# EAGLE design MPU6050 (EAGLE 9.6.2)
COMPANY: ADAFRUIT INDUSTRIES; DRAWN: KTOWN; REV: A; YEAR: 2019
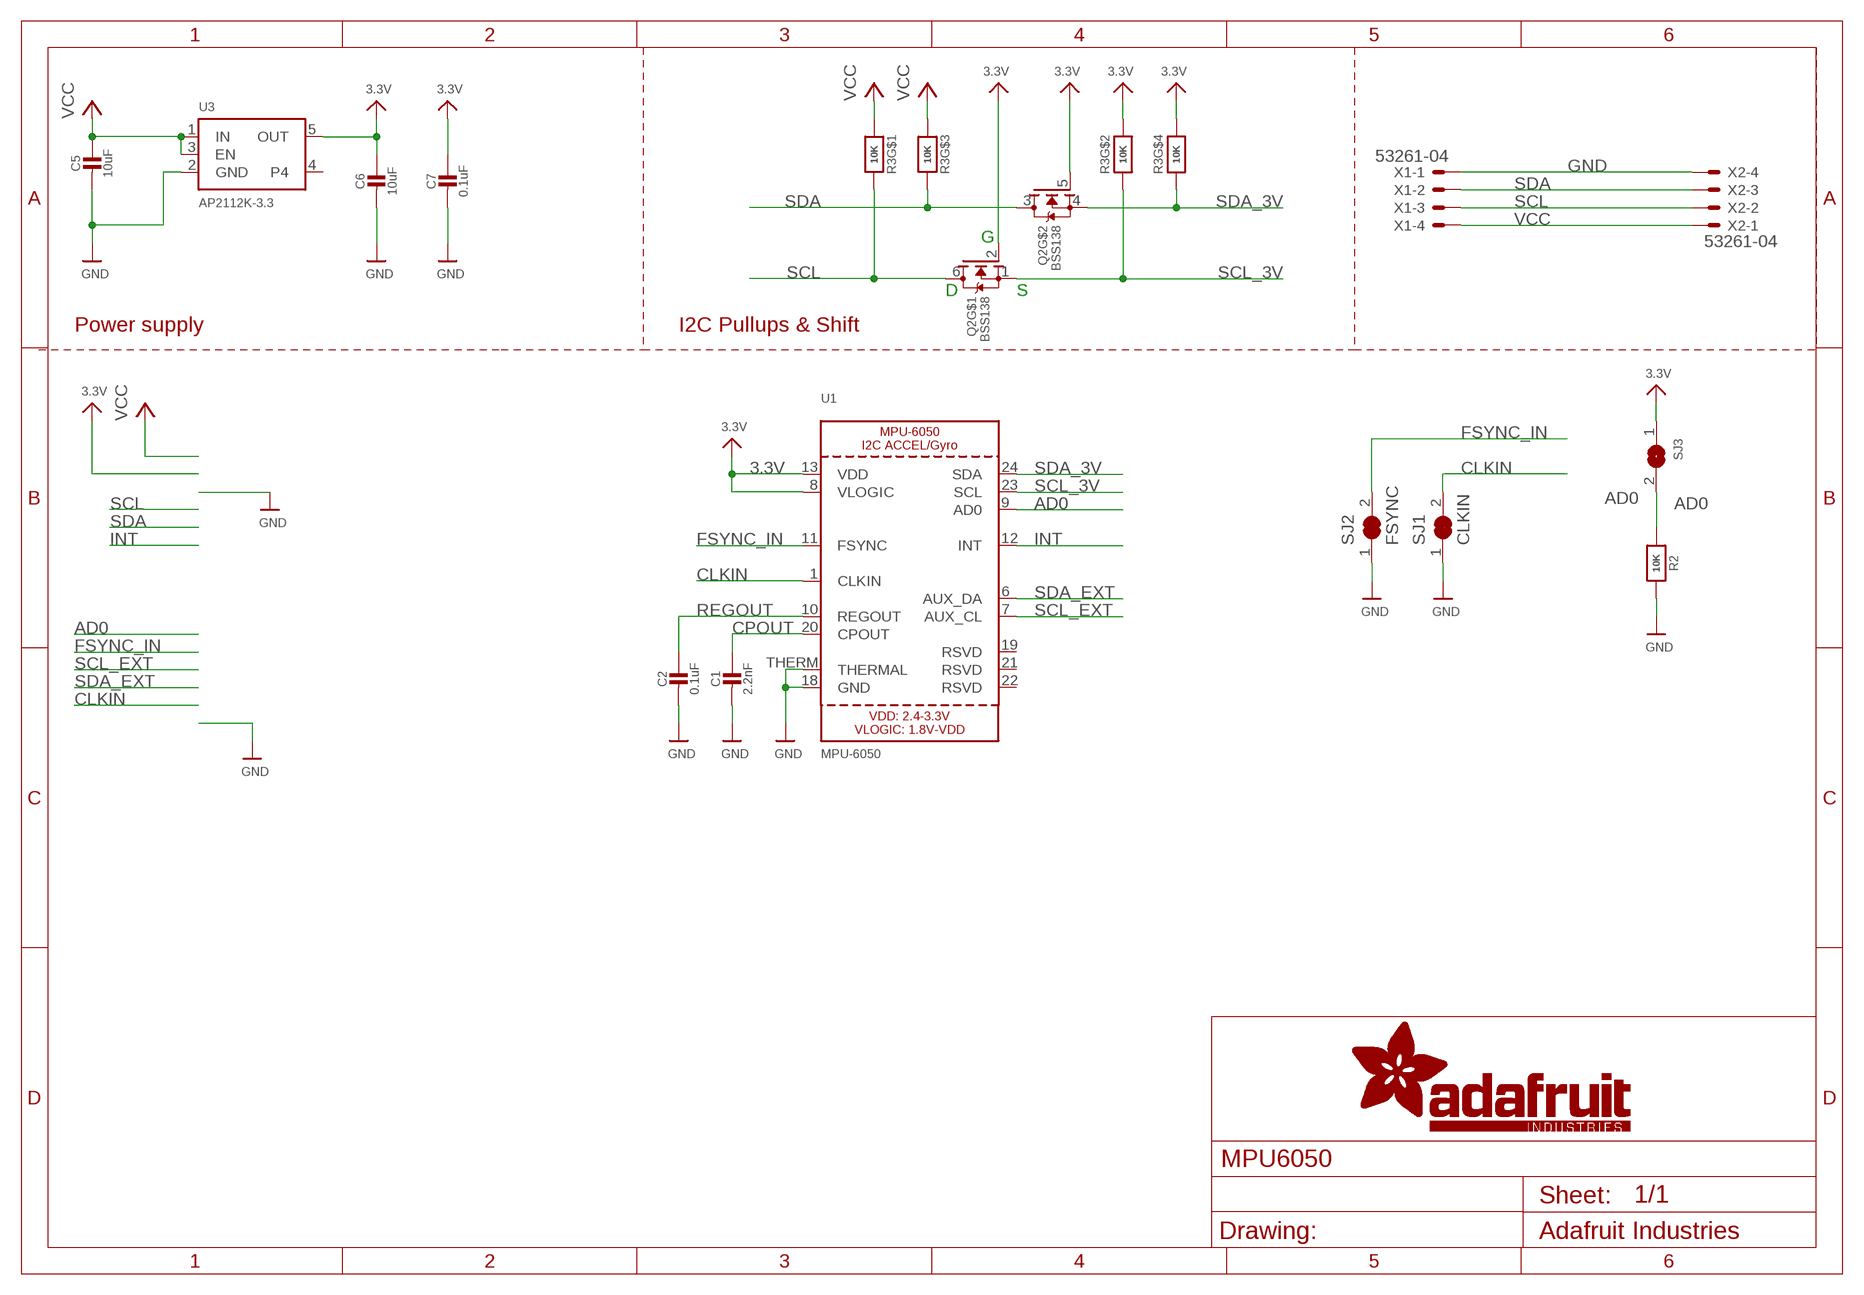
[diagram p0: schematic, sheet 1]

## Parts
C1  2.2nF  CAP_CERAMIC0603_NO  [0603-NO]
C2  0.1uF  CAP_CERAMIC0603_NO  [0603-NO]
C5  10uF  CAP_CERAMIC0805-NOOUTLINE  [0805-NO]
C6  10uF  CAP_CERAMIC0805-NOOUTLINE  [0805-NO]
C7  0.1uF  CAP_CERAMIC0603_NO  [0603-NO]
Q2  BSS138  MOSFET-N_DUAL  [SOT363]
R2  10K  RESISTOR_0603_NOOUT  [0603-NO]
R3  10K  RESISTOR_4PACK  [RESPACK_4X0603]
SJ1  CLKIN  SOLDERJUMPER_CLOSED  [SOLDERJUMPER_CLOSEDWIRE]
SJ2  FSYNC  SOLDERJUMPER_CLOSED  [SOLDERJUMPER_CLOSEDWIRE]
SJ3  SOLDERJUMPER  [SOLDERJUMPER_ARROW_NOPASTE]
U1  MPU-6050  [QFN24_4MM_SMSC]
U3  AP2112K-3.3  VREG_SOT23-5  [SOT23-5]
X1  53261-04  [53261-04]
X2  53261-04  [53261-04]

## Nets
3.3V: C6.1 C7.1 Q2.2(G) Q2.5(G) R3.2 R3.4 SJ3.1 U1.8(VLOGIC) U1.13(VDD) U3.5(OUT)
AD0: R2.1 SJ3.2 U1.9(AD0)
CLKIN: SJ1.2 U1.1(CLKIN)
CPOUT: C1.1 U1.20(CPOUT)
FSYNC_IN: SJ2.2 U1.11(FSYNC)
GND: C1.2 C2.2 C5.2 C6.2 C7.2 R2.2 SJ1.1 SJ2.1 U1.18(GND) U1.THERM(THERMAL) U3.2(GND) X1.1 X2.4
INT: U1.12(INT)
REGOUT: C2.1 U1.10(REGOUT)
SCL: Q2.6(D) R3.8 X1.3 X2.2
SCL_3V: Q2.1(S) R3.7 U1.23(SCL)
SCL_EXT: U1.7(AUX_CL)
SDA: Q2.3(D) R3.6 X1.2 X2.3
SDA_3V: Q2.4(S) R3.5 U1.24(SDA)
SDA_EXT: U1.6(AUX_DA)
VCC [highpower]: C5.1 R3.1 R3.3 U3.1(IN) U3.3(EN) X1.4 X2.1
Unconnected: U1.19(RSVD) U1.21(RSVD) U1.22(RSVD) U3.4

## Notes on the sheet
- G
- D | S
- Power supply | I2C Pullups & Shift

## Library data of the parts
C1 C2 C5-C7 = microbuilder:CAP_CERAMIC: Ceramic Capacitors For new designs, use the packages preceded by an '_' character since they are more reliable: The following footprints should be used on most boards: _0402 - Standard footprint for regular board layouts _0603 - Standard footprint for regular board layouts _0805 - Standard footprint for regular board layouts _1206 - Standard footprint for regular board layouts For extremely tight-pitch boards where space is at a premium, the following 'micro-pitch' footprints can be used (smaller pads, no silkscreen outline, etc.): _0402MP - Micro-pitch footprint for very dense/compact boards _0603MP - Micro-pitch footprint for very dense/compact boards _0805MP - Micro-pitch footprint for very dense/compact boards _1206MP - Micro-pitch footprint for very dense/compact boards
Q2 = microbuilder:MOSFET-N_DUAL: Dual N-Channel MOSFET SOT363 (2.0x1.25mm) 2N7002PS - 60V, 320mA [Digikey: 568-5984-1-ND]
R2 = microbuilder:RESISTOR: Resistors For new designs, use the packages preceded by an '_' character since they are more reliable: The following footprints should be used on most boards: _0402 - Standard footprint for regular board layouts _0603 - Standard footprint for regular board layouts _0805 - Standard footprint for regular board layouts _1206 - Standard footprint for regular board layouts For extremely tight-pitch boards where space is at a premium, the following 'micro-pitch' footprints can be used (smaller pads, no silkscreen outline, etc.): _0402MP - Micro-pitch footprint for very dense/compact boards _0603MP - Micro-pitch footprint for very dense/compact boards _0805MP - Micro-pitch footprint for very dense/compact boards _1206MP - Micro-pitch footprint for very dense/compact boards
R3 = microbuilder:RESISTOR_4PACK: Resistor Packs (4 resistors) 4 x 0603 10K 1/16W - Digikey: YC164J-10KCT-ND
SJ1 SJ2 = microbuilder:SOLDERJUMPER_CLOSED: Solder Jumper - Closed These solder jumpers are closed by default CLOSEDWIRE - 10 mil trace between pads that can be cut and resoldered later CLOSEDPERM - 63 mil trace between pads for a permanent connection (used to 'bridge' two signals, a shameless hack for Eagle). Can double as a test point as well (no cream layer)
SJ3 = microbuilder:SOLDERJUMPER: SMD Solder JUMPER Solder the two pads together to create a connection, or remove the solder to break it. REFLOW - Use this footprint for solder paste and reflow ovens. WAVE - Use this footprint for hand-soldering (larger pads). CLOSED - Has a trace between the two pads to ensure it is closed by default. The trace needs to be cut to disable the jumper, and can be closed again by creating a solder bridge between the two pads.; BOM: EXCLUDE
U1 = microbuilder:MPU-6050: MPU-6050 3-Axis Accelerometer/Gyroscope
U3 = microbuilder:VREG_SOT23-5: SOT23-5 Fixed Voltage Regulators Part Current Out V Out V In V Dropout θJA (°C/W) TJ (°C) Digikey Part No. ADP121 150mA 3.3V 3.4-5.5V 0.09V @ 150mA -- -- ADP121-AUJZ33R7CT-ND ADP121 150mA 3.0V 3.1-5.5V 0.09V @ 150mA -- -- ADP121-AUJZ30R7CT-ND ADP122 300mA 3.3V 3.4-5.5V 0.085V @ 300mA -- -- ADP122AUJZ-3.3-R7CT-ND ADP1712 300mA 3.3V 3.5-5.5V 0.17V @ 300mA -- -- ADP1712AUJZ-3.3-R7TR-ND AP7311 (Low Cost) 150mA 3.3V 3.5-6V 0.15V @ 150mA -- -- AP7311-33WG-7DICT-ND LD39015M18R 150mA 1.8V 1.9V-5.5V 0.08V @ 100mA -- -- 497-6977-1-ND LP2985A-33DBVR 150mA 3.3V 3.3-16V 0.28V @ 150mA 206 150 296-18479-1-ND MCP1824T-3302E/OT 300mA 3.3V 3.5V-6V 0.2V @ 300mA -- -- MCP1824T-3302E/OTCT-ND MIC5205-2.5YM5 TR 150mA 2.5V 2.7-16V 0.165V @ 150mA -- -- 576-1257-2-ND MIC5205-3.0YM5 TR 150mA 3.0V 3.2V-16V 0.165V @ 150mA -- -- 576-1258-2-ND MIC5205-3.3YM5 TR 150mA 3.3V 3.5V-16V 0.165V @ 150mA -- -- 576-1259-2-ND TPS780330220 150mA 3.3V+2.2V 3.6-5.5V 250mV Max -- -- 296-23332-1-ND TDA3663/N1,135 100mA 3.3V 3.5-45V 0.18V @ 50mA -- -- 568-5343-1-ND Max operating temp can be calculated using θJA, TJ (max junction temperature), and power in watts. Set the "Maximum Ambient Temperature" until it reaches TJ ("Max Junction Temperature"), which is the absolute limit for safe use of the regulator: Heat Sink Temperature Calculator <http://www.daycounter.com/Calculators/Heat-Sink-Temperature-Calculator.phtml> For example, With 12V source into a 3.3V LP2985 and a 30mA load, we are dissipating (12V-3.3V) * 0.03A = 0.261W. With a θJA of 206 °C/W, a TJ of 150°C, and 261mW we can safely use the chip without a heat sink up to 75°C (=147.1°C Junction Temperature).
X1 X2 = con-molex:53?-04: CONNECTOR wire to board 1.25 mm (.049 inch) pitch header; MF: MOLEX; OC_FARNELL: 1125374; OC_NEWARK: unknown

## Net classes
1 highpower: width 0.406 mm, drill 0.483 mm
2 lowpower: width 0.305 mm, drill 0.483 mm

## Board
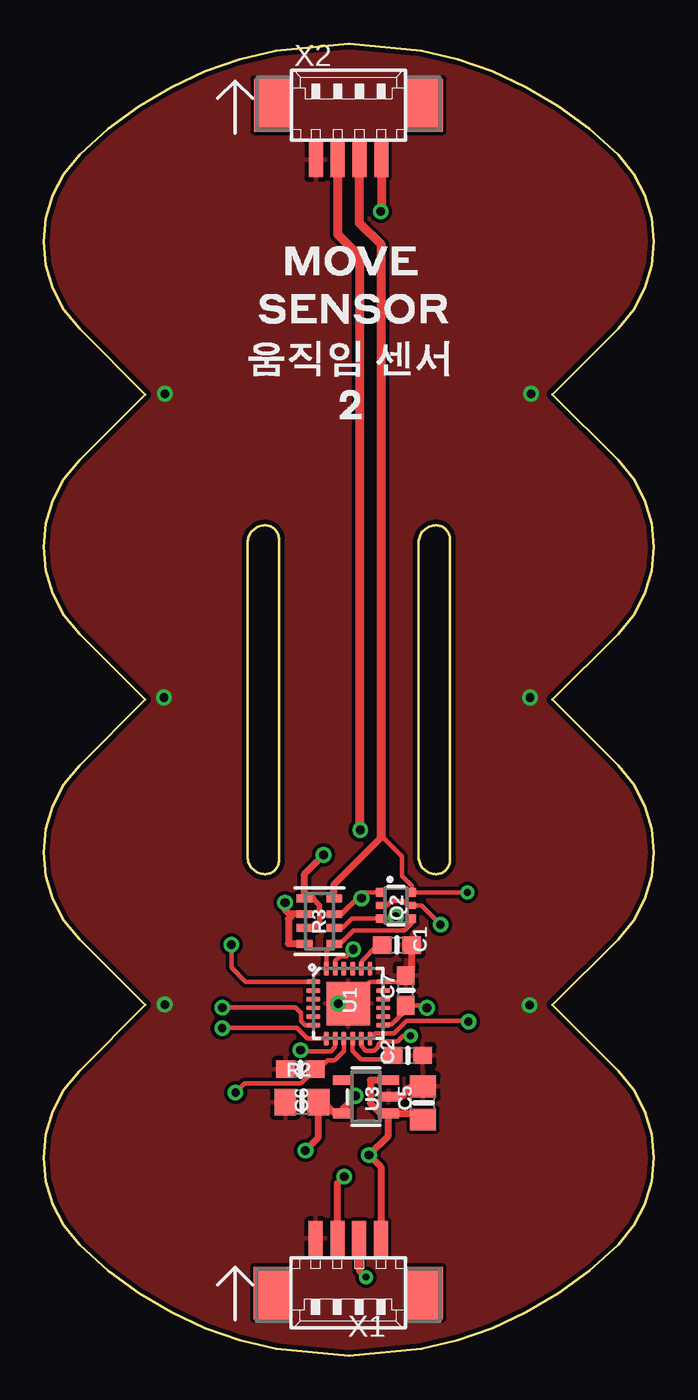
[diagram p1: board, top side]
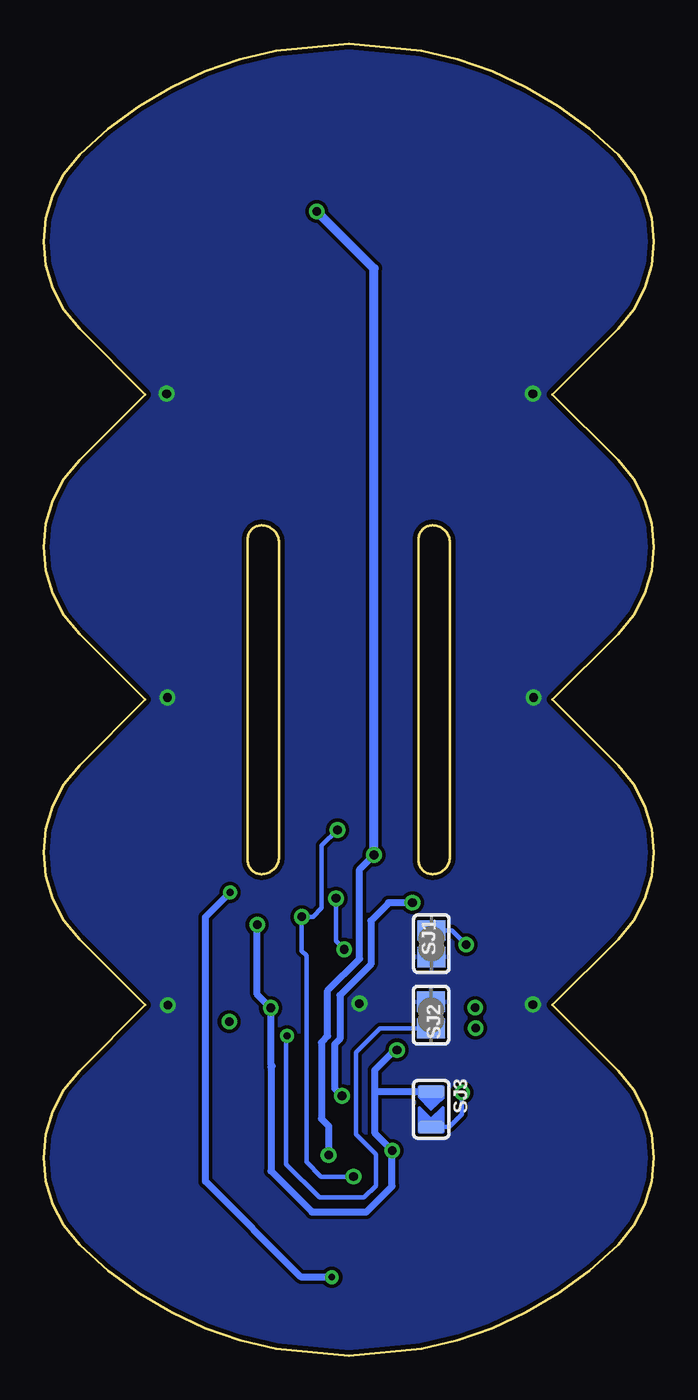
[diagram p2: board, bottom side, seen from below]

Size 35 x 75.22 mm. Coordinates in mm from the lower left corner, seen from the top.
Outline: 32.94,68.85 33.84,67.75 34.49,66.52 34.87,65.21 35,63.86 34.87,62.51 34.49,61.2 33.84,59.97 32.94,58.87 29.18,55.11 32.94,51.35 33.84,50.25 34.49,49.02 34.87,47.71 35,46.36 34.87,45.01 34.49,43.7 33.84,42.47 32.94,41.37 29.18,37.61 32.94,33.85 33.84,32.75 34.49,31.52 34.87,30.21 35,28.86 34.87,27.51 34.49,26.2 33.84,24.97 32.94,23.87 29.18,20.11 32.94,16.35 33.84,15.25 34.49,14.02 34.87,12.71 35,11.36 34.87,10.01 34.49,8.7 33.84,7.47 32.94,6.37 31.29,4.88 29.52,3.58 27.67,2.49 25.73,1.59 23.73,0.9 21.68,0.4 17.5,0 13.32,0.4 11.27,0.9 9.27,1.59 7.33,2.49 5.48,3.58 3.71,4.88 2.06,6.37
Outline: 32.94,68.85 32.94,68.85
Outline: 32.94,68.85 31.29,70.34 29.52,71.64 27.67,72.73 25.73,73.63 23.73,74.32 21.68,74.82 17.5,75.22 13.32,74.82 11.27,74.32 9.27,73.63 7.33,72.73 5.48,71.64 3.71,70.34 2.06,68.85 1.16,67.75 0.51,66.52 0.13,65.21 0,63.86 0.13,62.51 0.51,61.2 1.16,59.97 2.06,58.87 5.82,55.11 2.06,51.35 1.16,50.25 0.51,49.02 0.13,47.71 0,46.36 0.13,45.01 0.51,43.7 1.16,42.47 2.06,41.37 5.82,37.61 2.06,33.85 1.16,32.75 0.51,31.52 0.13,30.21 0,28.86 0.13,27.51 0.51,26.2 1.16,24.97 2.06,23.87 5.82,20.11 2.06,16.35 1.16,15.25 0.51,14.02 0.13,12.71 0,11.36 0.13,10.01 0.51,8.7 1.16,7.47 2.06,6.37
Outline: 2.06,6.37 2.06,6.37
Outline: 12.7,47.61 arc-90 13.5,46.81 13.5,28.41 arc-90 12.7,27.61 arc-90 11.7,28.61 11.7,46.61 arc-90 12.7,47.61
Outline: 22.5,47.61 arc-90 23.3,46.81 23.3,28.41 arc-90 22.5,27.61 arc-90 21.5,28.61 21.5,46.61 arc-90 22.5,47.61
Copper layers (1*16): Top 0.035mm / dielectric 1.5mm / Bottom 0.035mm
Design rules "adafruit 7-7": minimum track width 6mil, minimum drill 15.5mil, track to track 8mil, track to pad 7mil, pad to pad 7mil, via to via 7mil, smd to smd 7mil, copper to edge 10mil, drill to drill 8mil, minimum pad ring 10mil, minimum via ring 8mil, stop-mask expansion 2mil, vias tented up to drill 20mil, thermal gap 10mil

### Footprints (pad centres in the part's own frame; a part is rotated, then mirrored left to right if it is on the bottom)
0603-NO = smd 1.075 x 1: 1 -0.85,0; 2 0.85,0
0805-NO = smd 1.24 x 1.5: 1 -0.95,0; 2 0.95,0
SOT363 = smd 0.5 x 0.5: 1 -0.75,-0.9; 3 0.75,-0.9; 4 0.75,0.9; 6 -0.75,0.9 | smd 0.4 x 0.5: 2 0,-0.9; 5 0,0.9
RESPACK_4X0603 = smd 0.45 x 0.9: 1 -1.3,-0.85; 2 -0.4,-0.85; 3 0.4,-0.85; 4 1.3,-0.85; 5 1.3,0.85; 6 0.4,0.85; 7 -0.4,0.85; 8 -1.3,0.85
SOLDERJUMPER_CLOSEDWIRE = smd 1.168 x 1.6: 1 -0.762,0; 2 0.762,0 | smd 0.635 x 0.203: WIRE 0,0
SOLDERJUMPER_ARROW_NOPASTE = smd 0.762 x 1.524: 1 -1.016,0; 2 1.016,0
QFN24_4MM_SMSC = smd 0.8 x 0.28: 1 -2,1.25; 2 -2,0.75; 3 -2,0.25; 4 -2,-0.25; 5 -2,-0.75; 6 -2,-1.25; 13 2,-1.25; 14 2,-0.75; 15 2,-0.25; 16 2,0.25; 17 2,0.75; 18 2,1.25 | smd 0.28 x 0.8: 7 -1.25,-2; 8 -0.75,-2; 9 -0.25,-2; 10 0.25,-2; 11 0.75,-2; 12 1.25,-2; 19 1.25,2; 20 0.75,2; 21 0.25,2; 22 -0.25,2; 23 -0.75,2; 24 -1.25,2 | smd 2.5 x 2.5: THERM 0,0
SOT23-5 = smd 0.55 x 1.2: 1 -0.95,-1.3; 2 0,-1.3; 3 0.95,-1.3; 4 0.95,1.3; 5 -0.95,1.3
53261-04 = smd 0.8 x 2: 1 1.875,-2.5; 2 0.625,-2.5; 3 -0.625,-2.5; 4 -1.875,-2.5 | smd 2.1 x 3: S1 4.375,0.625; S2 -4.375,0.625

### Placement (x,y rotation side)
C1  20.26,23.55 0 top
C2  20.88,17.23 0 top
C5  21.76,14.5 90 top
C6  14.81,14.55 180 top
C7  20.77,20.95 90 top
Q2  20.21,25.81 270 top
R2  14.72,16.43 180 top
R3  15.82,24.92 270 top
SJ1  12.77,23.63 90 bottom
SJ2  12.79,19.53 270 bottom
SJ3  12.78,14.13 270 bottom
U1  17.47,20.2 0 top
U3  18.48,14.85 90 top
X1  17.47,4.24 180 top
X2  17.49,71.06 0 top

### Tracks (layer width: path | path; a pad name or v marks a point on that pad's centre or on a via)
3.3V  (via drill 0.48, 0.5)
  Top 0.254: U1.8 16.72,17.71 16.47,17.47 14.8,17.47 v14.74,17.53 | Q2.2 19.69,25.81 19.94,26.06 20.6,26.06 20.86,25.81 Q2.5 21.67,25.81 v22.76,24.73 | U1.13 19.52,19 19.95,19 20.49,19.54 20.49,19.53 20.77,19.8 C7.1 21.53,20.1 21.68,19.95 v21.98,19.95 | 15.74,14.47 C6.1
  Top 0.406: v17.88,14.9 17.18,14.2 U3.5 16.68,13.9 16.11,14.47 15.73,14.47 15.76,14.51 C6.1 15.76,12.53 v15.01,11.78 v15.01,11.77 | R3.4 14.04,23.62 14.04,25.02 14.21,25.19 14.08,25.32 | R3.2 14.08,25.32 | 14.08,25.32 13.85,25.56 v13.85,25.98
  Bottom 0.254: 21.99,16.72 21.89,16.62
  Bottom 0.406: v17.88,14.9 18.32,15.33 18.32,17.86 18.02,18.16 18.02,20.67 16.23,22.45 16.23,24.94 15.23,25.95 15.23,25.98 v13.85,25.98 | 21.89,16.62 21.97,16.54 21.97,10.6 19.62,8.25 16.49,8.25 15.01,9.73 v15.01,11.77 16.03,12.79 16.03,15.24 | v14.74,17.53 14.86,17.53 16.03,16.37 16.03,15.24 | SJ3.1 15.93,15.15 16.03,15.24 | v22.76,24.73 22.76,20.73 v21.98,19.95 v21.99,19.94 21.99,16.72
AD0  (via drill 0.48)
  Top 0.254: U1.9 17.22,17.47 16.68,16.93 16.28,16.93 15.78,16.43 R2.1 14.76,15.61 11.52,15.61 v11.01,15.1
  Bottom 0.254: 12.71,13.25 12.78,13.18 SJ3.2 11.74,13.12 11.01,13.84 v11.01,15.1
CLKIN  (via drill 0.48)
  Top 0.254: U1.1 11.59,21.45 10.77,22.26 v10.77,23.57
  Bottom 0.254: SJ1.2 11.59,24.39 v10.77,23.57
CPOUT
  Top 0.254: U1.20 18.22,22.58 18.27,22.63 18.27,22.68 19.14,23.55 C1.1
FSYNC_IN  (via drill 0.4)
  Top 0.254: U1.11 18.22,17.76 18.5,17.49 18.94,17.49 19.19,17.74 19.19,17.85 19.37,18.03 20.3,18.03 20.62,18.34 v21.05,18.34
  Bottom 0.254: v21.05,18.34 21.09,18.31 21.09,10.98 19.19,9.08 16.62,9.08 15.94,9.76 15.94,11.56 17.09,12.7 17.09,17.4 15.72,18.77 SJ2.2
GND  (via drill 0.5)
  Top 0.254: v16.9,20.2 U1.THERM 18.72,21.45 U1.18 20.42,21.45 C7.2
  Top 0.406: U3.2 20.53,14.85 21.13,15.45 C5.2 | C7.2 21.11,22.14 C1.2
  other vias: 6.9,37.74 6.95,55.15 27.95,55.15 27.9,37.74 27.87,20.1 6.95,20.14
  pour Top: -0.02,75.86 35.38,75.86 35.38,0.08 -0.02,0.08
  pour Bottom: -0.02,76.86 35.38,76.86 35.38,0.08 -0.02,0.08
INT  (via drill 0.48)
  Top 0.254: U1.12 19.01,18.5 19.27,18.5 19.28,18.49 20.1,18.49 20.8,19.19 24.36,19.19
  Top 0.406: 24.36,19.19 v24.36,19.17
REGOUT
  Top 0.254: C2.1 19.81,17 18.2,17 17.72,17.49 U1.10
SCL  (via drill 0.39)
  Top 0.254: 16.67,26.4 R3.8 | v24.3,26.57 v24.29,26.56 Q2.6 21.11,26.94 20.54,27.51 20.54,28.63 19.38,29.79 19.36,29.81
  Top 0.406: R3.8 16.67,27.04 19.36,29.73 19.36,29.81 | 19.38,29.79 19.38,29.7 | X1.3 18.09,4.9 v18.48,4.52
  Top 0.508: 19.36,29.81 19.36,63.68 18.11,64.93 X2.2
  Bottom 0.406: v18.48,4.52 20.24,4.52 25.72,10 25.72,25.15 v24.3,26.57
SCL_3V  (via drill 0.5)
  Top 0.254: v18.23,26.23 17.97,26.23 17.07,25.32 R3.7 17.12,25.32 18.36,26.56 Q2.1 | U1.23 16.72,22.63 16.99,22.9 17.38,22.9 17.76,23.28 v17.76,23.3
  Bottom 0.254: v18.23,26.23 18.23,23.77 v17.76,23.3
SCL_EXT  (via drill 0.48)
  Top 0.254: U1.7 15.13,18.2 14.53,18.8 v10.24,18.8
SDA  (via drill 0.5)
  Top 0.254: R3.6 17.14,24.52 17.68,25.07 20.2,25.07 v20.2,25.17 20.14,25.07 Q2.3
  Top 0.406: X1.2 16.84,9.88 v17.23,10.28 | 18.11,30.19 v18.15,30.15
  Top 0.508: X2.3 16.86,64.29 18.15,63 v18.15,30.15
  Bottom 0.254: v18.15,30.15 19.05,29.25 19.05,25.68 19.56,25.17 v20.2,25.17 20.2,23.21 19.93,22.95 19.93,11.12 19.08,10.28 v17.23,10.28
SDA_3V
  Top 0.254: U1.24 16.22,23.17 R3.5 17,23.62 17.76,24.38 20.68,24.38 21.11,24.81 Q2.4
SDA_EXT  (via drill 0.48)
  Top 0.254: U1.6 15.02,18.95 14.76,19.21 14.76,19.66 14.45,19.97 v10.26,19.97
VCC  (via drill 0.48, 0.5)
  Top 0.305: 15.57,24.52 15.83,24.79 15.83,25.83 15.44,26.22
  Top 0.406: U3.3 18.74,15.8 18.74,14.48 19.32,13.9 U3.1 | U3.1 21.91,13.9 C5.1 | R3.3 15.57,24.52 | 15.44,26.22 R3.1 14.97,27.62 v16.05,28.71 | U3.1 19.76,13.88 19.76,12.62 v18.65,11.51 19.34,10.83 X1.4
  Top 0.508: 18.66,11.51 v18.65,11.51 | v19.33,65.6 19.36,65.63 X2.1
  Bottom 0.406: v16.05,28.71 16.06,28.71 16.88,27.89 16.88,22.77 18.71,20.94 18.71,18.33 19.07,17.97 19.07,13.59 18.65,13.18 v18.65,11.51
  Bottom 0.508: v16.05,28.71 16.05,62.32 v19.33,65.6